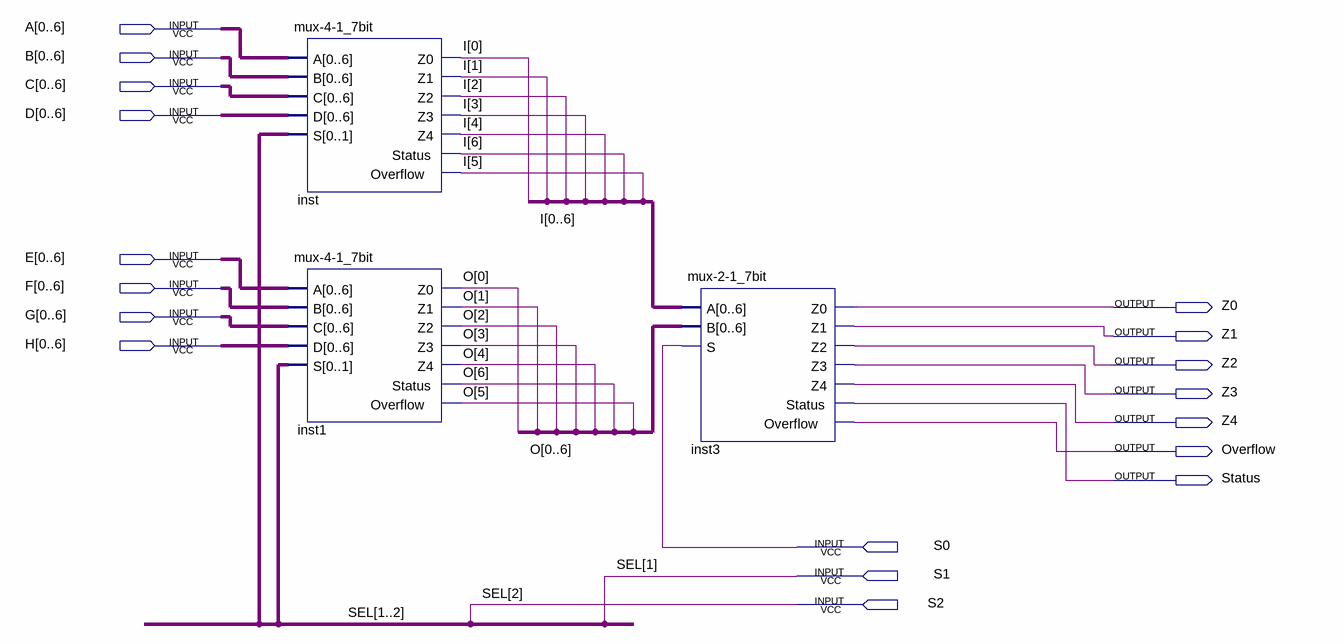
[diagram p0: schematic sheet]
// Quartus schematic mux-8-1_7bit.bdf as structural Verilog: 3 symbols, 18 pins
module \mux-8-1_7bit  (
  input  [0:6] A,
  input  [0:6] B,
  input  [0:6] C,
  input  [0:6] D,
  input  [0:6] E,
  input  [0:6] F,
  input  [0:6] G,
  input  [0:6] H,
  input  S0,
  input  S1,
  input  S2,
  output Z0,
  output Z1,
  output Z2,
  output Z3,
  output Z4,
  output Overflow,
  output Status
);

  wire [6:0] I, O;

  \mux-4-1_7bit  inst (
    .A(A), .B(B), .C(C), .D(D), .S({S1, S2}), .Z0(I[0]), .Z1(I[1]), .Z2(I[2]), .Z3(I[3]), .Z4(I[4]),
    .Status(I[6]), .Overflow(I[5]));
  \mux-4-1_7bit  inst1 (
    .A(E), .B(F), .C(G), .D(H), .S({S1, S2}), .Z0(O[0]), .Z1(O[1]), .Z2(O[2]), .Z3(O[3]), .Z4(O[4]),
    .Status(O[6]), .Overflow(O[5]));
  \mux-2-1_7bit  inst3 (
    .A({I[0], I[1], I[2], I[3], I[4], I[5], I[6]}), .B({O[0], O[1], O[2], O[3], O[4], O[5], O[6]}), .S(S0),
    .Z0(Z0), .Z1(Z1), .Z2(Z2), .Z3(Z3), .Z4(Z4), .Status(Status), .Overflow(Overflow));

  // Other names for the same wires on the sheet: SEL[2:1] = {S2, S1}
endmodule
